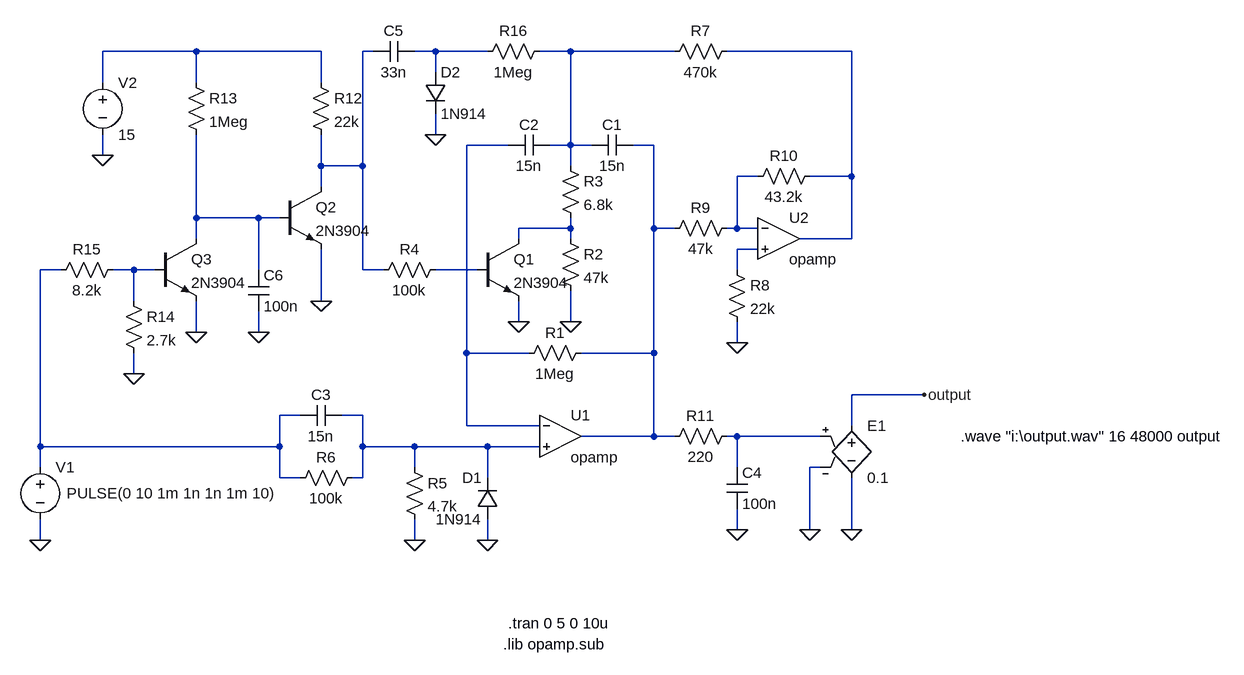
[diagram p0: schematic 808bd.asc]
808bd.asc, the LTspice schematic file:
Version 4
SHEET 1 1224 680
WIRE -384 -400 -528 -400
WIRE -192 -400 -384 -400
WIRE -112 -400 -128 -400
WIRE -16 -400 -48 -400
WIRE 64 -400 -16 -400
WIRE 192 -400 144 -400
WIRE 352 -400 192 -400
WIRE 624 -400 432 -400
WIRE -16 -368 -16 -400
WIRE -528 -352 -528 -400
WIRE -384 -352 -384 -400
WIRE -192 -352 -192 -400
WIRE -16 -272 -16 -304
WIRE 96 -256 32 -256
WIRE 192 -256 192 -400
WIRE 192 -256 160 -256
WIRE 224 -256 192 -256
WIRE 320 -256 288 -256
WIRE -528 -240 -528 -272
WIRE -192 -224 -192 -272
WIRE -128 -224 -128 -400
WIRE -128 -224 -192 -224
WIRE 192 -224 192 -256
WIRE 480 -208 448 -208
WIRE 624 -208 624 -400
WIRE 624 -208 560 -208
WIRE -192 -192 -192 -224
WIRE -384 -144 -384 -272
WIRE -288 -144 -384 -144
WIRE -256 -144 -288 -144
WIRE 192 -128 192 -144
WIRE 192 -128 112 -128
WIRE 320 -128 320 -256
WIRE 352 -128 320 -128
WIRE 448 -128 448 -208
WIRE 448 -128 432 -128
WIRE 480 -128 448 -128
WIRE -384 -112 -384 -144
WIRE 112 -112 112 -128
WIRE 192 -112 192 -128
WIRE 624 -112 624 -208
WIRE 624 -112 544 -112
WIRE 480 -96 448 -96
WIRE -592 -64 -624 -64
WIRE -480 -64 -512 -64
WIRE -448 -64 -480 -64
WIRE -288 -64 -288 -144
WIRE -128 -64 -128 -224
WIRE -96 -64 -128 -64
WIRE 48 -64 -16 -64
WIRE 448 -64 448 -96
WIRE -480 -16 -480 -64
WIRE -192 -16 -192 -96
WIRE 112 16 112 -16
WIRE 192 16 192 -32
WIRE -384 32 -384 -16
WIRE -288 32 -288 0
WIRE 448 48 448 16
WIRE 32 64 32 -256
WIRE 128 64 32 64
WIRE 320 64 320 -128
WIRE 320 64 208 64
WIRE -480 96 -480 64
WIRE 736 128 624 128
WIRE -224 160 -256 160
WIRE -128 160 -160 160
WIRE 32 176 32 64
WIRE 144 176 32 176
WIRE 624 176 624 128
WIRE 320 192 320 64
WIRE 320 192 208 192
WIRE 352 192 320 192
WIRE 448 192 432 192
WIRE 576 192 448 192
WIRE -624 208 -624 -64
WIRE -256 208 -256 160
WIRE -256 208 -624 208
WIRE -128 208 -128 160
WIRE -48 208 -128 208
WIRE 64 208 -48 208
WIRE 144 208 64 208
WIRE -624 240 -624 208
WIRE -48 240 -48 208
WIRE 448 240 448 192
WIRE 576 240 560 240
WIRE -256 256 -256 208
WIRE -224 256 -256 256
WIRE -128 256 -128 208
WIRE -128 256 -144 256
WIRE 64 256 64 208
WIRE 448 336 448 304
WIRE 560 336 560 240
WIRE 624 336 624 256
WIRE -624 352 -624 320
WIRE -48 352 -48 320
WIRE 64 352 64 320
FLAG 112 16 0
FLAG 192 16 0
FLAG 64 352 0
FLAG -48 352 0
FLAG -624 352 0
FLAG 448 48 0
FLAG 448 336 0
FLAG 624 336 0
FLAG 560 336 0
FLAG 736 128 output
FLAG -192 -16 0
FLAG -384 32 0
FLAG -528 -240 0
FLAG -16 -272 0
FLAG -480 96 0
FLAG -288 32 0
SYMBOL Opamps\\opamp 176 128 R0
SYMATTR InstName U1
SYMBOL res 224 48 R90
WINDOW 0 0 56 VBottom 2
WINDOW 3 32 56 VTop 2
SYMATTR InstName R1
SYMATTR Value 1Meg
SYMBOL npn 48 -112 R0
SYMATTR InstName Q1
SYMATTR Value 2N3904
SYMBOL res 176 -128 R0
SYMATTR InstName R2
SYMATTR Value 47k
SYMBOL res 176 -240 R0
SYMATTR InstName R3
SYMATTR Value 6.8k
SYMBOL cap 288 -272 R90
WINDOW 0 0 32 VBottom 2
WINDOW 3 32 32 VTop 2
SYMATTR InstName C1
SYMATTR Value 15n
SYMBOL cap 160 -272 R90
WINDOW 0 0 32 VBottom 2
WINDOW 3 32 32 VTop 2
SYMATTR InstName C2
SYMATTR Value 15n
SYMBOL res 0 -80 R90
WINDOW 0 0 56 VBottom 2
WINDOW 3 32 56 VTop 2
SYMATTR InstName R4
SYMATTR Value 100k
SYMBOL diode 80 320 R180
WINDOW 0 24 64 Left 2
WINDOW 3 24 0 Left 2
SYMATTR InstName D1
SYMATTR Value 1N914
SYMBOL res -64 224 R0
SYMATTR InstName R5
SYMATTR Value 4.7k
SYMBOL res -128 240 R90
WINDOW 0 0 56 VBottom 2
WINDOW 3 32 56 VTop 2
SYMATTR InstName R6
SYMATTR Value 100k
SYMBOL cap -160 144 R90
WINDOW 0 0 32 VBottom 2
WINDOW 3 32 32 VTop 2
SYMATTR InstName C3
SYMATTR Value 15n
SYMBOL voltage -624 224 R0
WINDOW 3 41 56 Left 2
WINDOW 123 0 0 Left 2
WINDOW 39 0 0 Left 2
SYMATTR Value PULSE(0 10 1m 1n 1n 1m 10)
SYMATTR InstName V1
SYMBOL Opamps\\opamp 512 -176 R0
SYMATTR InstName U2
SYMBOL res 448 -416 R90
WINDOW 0 0 56 VBottom 2
WINDOW 3 32 56 VTop 2
SYMATTR InstName R7
SYMATTR Value 470k
SYMBOL res 432 -80 R0
SYMATTR InstName R8
SYMATTR Value 22k
SYMBOL res 448 -144 R90
WINDOW 0 0 56 VBottom 2
WINDOW 3 32 56 VTop 2
SYMATTR InstName R9
SYMATTR Value 47k
SYMBOL res 576 -224 R90
WINDOW 0 0 56 VBottom 2
WINDOW 3 32 56 VTop 2
SYMATTR InstName R10
SYMATTR Value 43.2k
SYMBOL res 448 176 R90
WINDOW 0 0 56 VBottom 2
WINDOW 3 32 56 VTop 2
SYMATTR InstName R11
SYMATTR Value 220
SYMBOL cap 432 240 R0
SYMATTR InstName C4
SYMATTR Value 100n
SYMBOL e 624 160 R0
SYMATTR InstName E1
SYMATTR Value 0.1
SYMBOL npn -256 -192 R0
SYMATTR InstName Q2
SYMATTR Value 2N3904
SYMBOL npn -448 -112 R0
SYMATTR InstName Q3
SYMATTR Value 2N3904
SYMBOL res -208 -368 R0
SYMATTR InstName R12
SYMATTR Value 22k
SYMBOL res -400 -368 R0
SYMATTR InstName R13
SYMATTR Value 1Meg
SYMBOL res -496 -32 R0
SYMATTR InstName R14
SYMATTR Value 2.7k
SYMBOL res -496 -80 R90
WINDOW 0 0 56 VBottom 2
WINDOW 3 32 56 VTop 2
SYMATTR InstName R15
SYMATTR Value 8.2k
SYMBOL voltage -528 -368 R0
WINDOW 123 0 0 Left 2
WINDOW 39 0 0 Left 2
SYMATTR InstName V2
SYMATTR Value 15
SYMBOL cap -48 -416 R90
WINDOW 0 0 32 VBottom 2
WINDOW 3 32 32 VTop 2
SYMATTR InstName C5
SYMATTR Value 33n
SYMBOL res 160 -416 R90
WINDOW 0 0 56 VBottom 2
WINDOW 3 32 56 VTop 2
SYMATTR InstName R16
SYMATTR Value 1Meg
SYMBOL diode -32 -368 R0
SYMATTR InstName D2
SYMATTR Value 1N914
SYMBOL cap -304 -64 R0
SYMATTR InstName C6
SYMATTR Value 100n
TEXT 88 512 Left 2 !.lib opamp.sub
TEXT 96 480 Left 2 !.tran 0 5 0 10u
TEXT 792 192 Left 2 !.wave "i:\\output.wav" 16 48000 output

The netlist it stands for:
* 808bd.asc
XU1 N006 N015 N007 opamp Aol=100K GBW=10Meg  ; pins invin noninvin out
R1 N007 N006 1Meg
Q1 N010 N014 0 0 2N3904
R2 N010 0 47k
R3 N004 N010 6.8k
C1 N007 N004 15n
C2 N004 N006 15n
R4 N014 N002 100k
D1 0 N015 1N914
R5 N015 0 4.7k
R6 N015 N012 100k
C3 N015 N012 15n
V1 N012 0 PULSE(0 10 1m 1n 1n 1m 10)
XU2 N008 N011 N005 opamp Aol=100K GBW=10Meg  ; pins invin noninvin out
R7 N005 N004 470k
R8 N011 0 22k
R9 N008 N007 47k
R10 N005 N008 43.2k
R11 N016 N007 220
C4 N016 0 100n
E1 output 0 N016 0 0.1
Q2 N002 N009 0 0 2N3904
Q3 N009 N013 0 0 2N3904
R12 N001 N002 22k
R13 N001 N009 1Meg
R14 N013 0 2.7k
R15 N013 N012 8.2k
V2 N001 0 15
C5 N003 N002 33n
R16 N004 N003 1Meg
D2 N003 0 1N914
C6 N009 0 100n
.model D D
.lib standard.dio
.model NPN NPN
.model PNP PNP
.lib standard.bjt
.lib opamp.sub
.tran 0 5 0 10u
.wave "i:\output.wav" 16 48000 output
.backanno
.end